# EAGLE schematic RADAR_Main_Board (EAGLE 7.4.0), part 1 of 3

## Sheet 1 of 4: POWER SUPPLIES
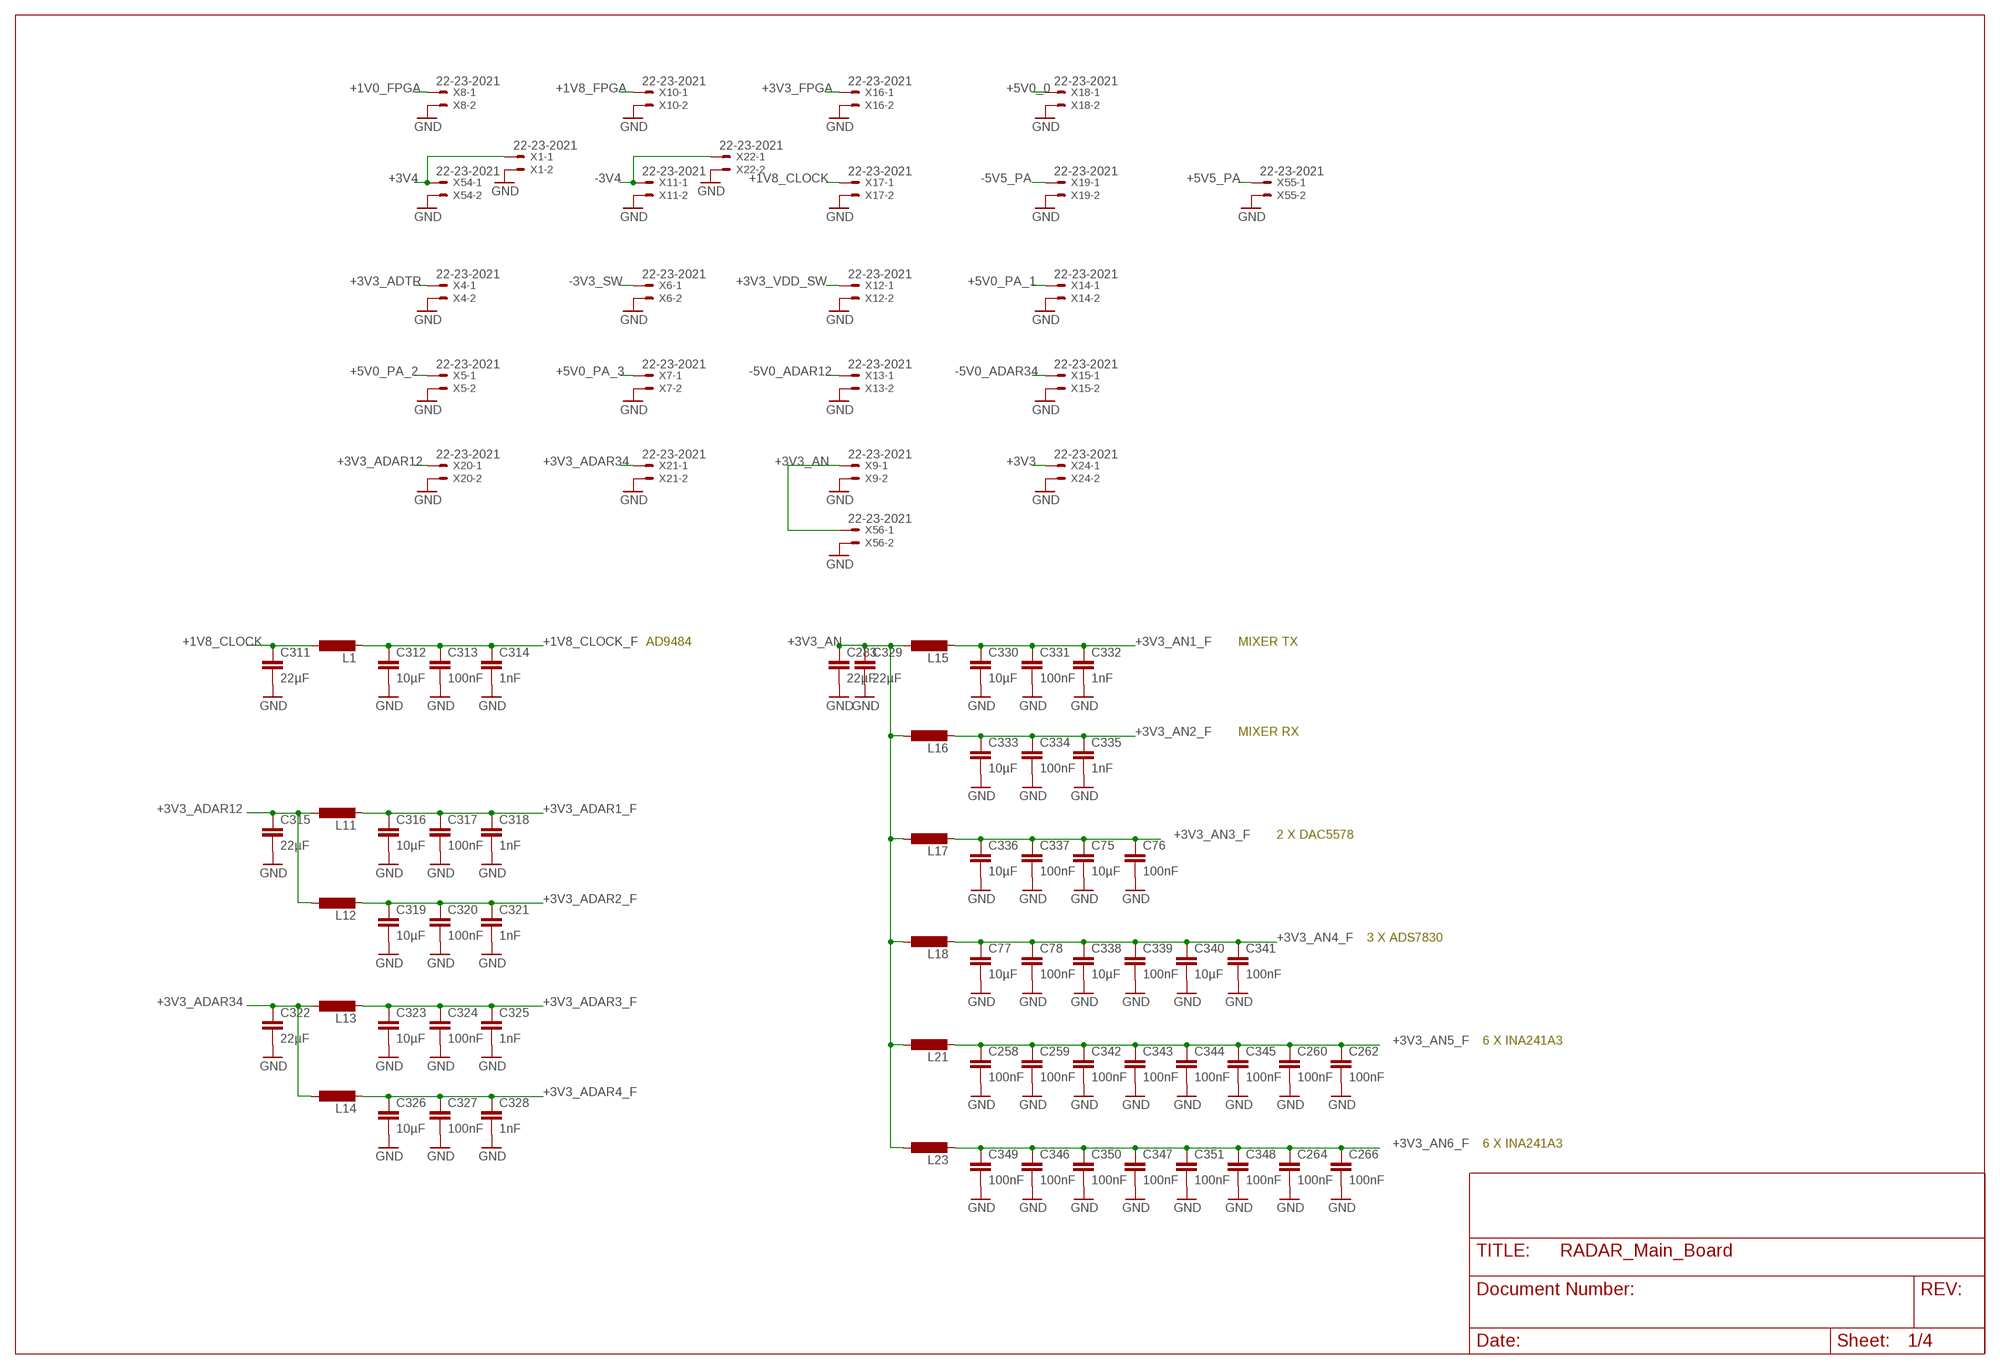
[diagram p0: schematic, sheet 1]

### Parts
C75  10µF  C-EUC0805  [C0805]
C76  100nF  C-EUC0402  [C0402]
C77  10µF  C-EUC0805  [C0805]
C78  100nF  C-EUC0402  [C0402]
C258  100nF  C-EUC0402  [C0402]
C259  100nF  C-EUC0402  [C0402]
C260  100nF  C-EUC0402  [C0402]
C262  100nF  C-EUC0402  [C0402]
C264  100nF  C-EUC0402  [C0402]
C266  100nF  C-EUC0402  [C0402]
C283  22µF  C-EUC1206  [C1206]
C311  22µF  C-EUC1206  [C1206]
C312  10µF  C-EUC0805  [C0805]
C313  100nF  C-EUC0402  [C0402]
C314  1nF  C-EUC0402  [C0402]
C315  22µF  C-EUC1206  [C1206]
C316  10µF  C-EUC0805  [C0805]
C317  100nF  C-EUC0402  [C0402]
C318  1nF  C-EUC0402  [C0402]
C319  10µF  C-EUC0805  [C0805]
C320  100nF  C-EUC0402  [C0402]
C321  1nF  C-EUC0402  [C0402]
C322  22µF  C-EUC1206  [C1206]
C323  10µF  C-EUC0805  [C0805]
C324  100nF  C-EUC0402  [C0402]
C325  1nF  C-EUC0402  [C0402]
C326  10µF  C-EUC0805  [C0805]
C327  100nF  C-EUC0402  [C0402]
C328  1nF  C-EUC0402  [C0402]
C329  22µF  C-EUC1206  [C1206]
C330  10µF  C-EUC0805  [C0805]
C331  100nF  C-EUC0402  [C0402]
C332  1nF  C-EUC0402  [C0402]
C333  10µF  C-EUC0805  [C0805]
C334  100nF  C-EUC0402  [C0402]
C335  1nF  C-EUC0402  [C0402]
C336  10µF  C-EUC0805  [C0805]
C337  100nF  C-EUC0402  [C0402]
C338  10µF  C-EUC0805  [C0805]
C339  100nF  C-EUC0402  [C0402]
C340  10µF  C-EUC0805  [C0805]
C341  100nF  C-EUC0402  [C0402]
C342  100nF  C-EUC0402  [C0402]
C343  100nF  C-EUC0402  [C0402]
C344  100nF  C-EUC0402  [C0402]
C345  100nF  C-EUC0402  [C0402]
C346  100nF  C-EUC0402  [C0402]
C347  100nF  C-EUC0402  [C0402]
C348  100nF  C-EUC0402  [C0402]
C349  100nF  C-EUC0402  [C0402]
C350  100nF  C-EUC0402  [C0402]
C351  100nF  C-EUC0402  [C0402]
L1  L-EUL5650M  [L5650M]
L11  L-EUL5650M  [L5650M]
L12  L-EUL5650M  [L5650M]
L13  L-EUL5650M  [L5650M]
L14  L-EUL5650M  [L5650M]
L15  L-EUL5650M  [L5650M]
L16  L-EUL5650M  [L5650M]
L17  L-EUL5650M  [L5650M]
L18  L-EUL5650M  [L5650M]
L21  L-EUL5650M  [L5650M]
L23  L-EUL5650M  [L5650M]
X1  22-23-2021  [22-23-2021]
X4  22-23-2021  [22-23-2021]
X5  22-23-2021  [22-23-2021]
X6  22-23-2021  [22-23-2021]
X7  22-23-2021  [22-23-2021]
X8  22-23-2021  [22-23-2021]
X9  22-23-2021  [22-23-2021]
X10  22-23-2021  [22-23-2021]
X11  22-23-2021  [22-23-2021]
X12  22-23-2021  [22-23-2021]
X13  22-23-2021  [22-23-2021]
X14  22-23-2021  [22-23-2021]
X15  22-23-2021  [22-23-2021]
X16  22-23-2021  [22-23-2021]
X17  22-23-2021  [22-23-2021]
X18  22-23-2021  [22-23-2021]
X19  22-23-2021  [22-23-2021]
X20  22-23-2021  [22-23-2021]
X21  22-23-2021  [22-23-2021]
X22  22-23-2021  [22-23-2021]
X24  22-23-2021  [22-23-2021]
X54  22-23-2021  [22-23-2021]
X55  22-23-2021  [22-23-2021]
X56  22-23-2021  [22-23-2021]

### Nets
+1V0_FPGA: X8.1 ; also sheet 2
+1V8_CLOCK: C311.1 L1.1 X17.1
+1V8_CLOCK_F: C312.1 C313.1 C314.1 L1.2 ; also sheet 3
+1V8_FPGA: X10.1 ; also sheet 2,3
+3V3: X24.1 ; also sheet 2
+3V3_ADAR1_F: C316.1 C317.1 C318.1 L11.2 ; also sheet 3
+3V3_ADAR2_F: C319.1 C320.1 C321.1 L12.2 ; also sheet 3
+3V3_ADAR3_F: C323.1 C324.1 C325.1 L13.2 ; also sheet 3
+3V3_ADAR4_F: C326.1 C327.1 C328.1 L14.2 ; also sheet 3
+3V3_ADAR12: C315.1 L11.1 L12.1 X20.1
+3V3_ADAR34: C322.1 L13.1 L14.1 X21.1
+3V3_ADTR: X4.1 ; also sheet 3
+3V3_AN: C283.1 C329.1 L15.1 L16.1 L17.1 L18.1 L21.1 L23.1 X9.1 X56.1 ; also sheet 3
+3V3_AN1_F: C330.1 C331.1 C332.1 L15.2 ; also sheet 3
+3V3_AN2_F: C333.1 C334.1 C335.1 L16.2 ; also sheet 3
+3V3_AN3_F: C75.1 C76.1 C336.1 C337.1 L17.2 ; also sheet 4
+3V3_AN4_F: C77.1 C78.1 C338.1 C339.1 C340.1 C341.1 L18.2 ; also sheet 4
+3V3_AN5_F: C258.1 C259.1 C260.1 C262.1 C342.1 C343.1 C344.1 C345.1 L21.2 ; also sheet 4
+3V3_AN6_F: C264.1 C266.1 C346.1 C347.1 C348.1 C349.1 C350.1 C351.1 L23.2 ; also sheet 4
+3V3_FPGA: X16.1 ; also sheet 2,3
+3V3_VDD_SW: X12.1 ; also sheet 3
+3V4: X1.1 X54.1 ; also sheet 3
+5V0_0: X18.1 ; also sheet 3
+5V0_PA_1: X14.1 ; also sheet 3
+5V0_PA_2: X5.1 ; also sheet 3
+5V0_PA_3: X7.1 ; also sheet 3
+5V5_PA: X55.1 ; also sheet 4
-3V3_SW: X6.1 ; also sheet 3
-3V4: X11.1 X22.1 ; also sheet 3
-5V0_ADAR12: X13.1 ; also sheet 3
-5V0_ADAR34: X15.1 ; also sheet 3
-5V5_PA: X19.1 ; also sheet 4
GND: C75.2 C76.2 C77.2 C78.2 C258.2 C259.2 C260.2 C262.2 C264.2 C266.2 C283.2 C311.2 C312.2 C313.2 C314.2 C315.2 C316.2 C317.2 C318.2 C319.2 C320.2 C321.2 C322.2 C323.2 C324.2 C325.2 C326.2 C327.2 C328.2 C329.2 C330.2 C331.2 C332.2 C333.2 C334.2 C335.2 C336.2 C337.2 C338.2 C339.2 C340.2 C341.2 C342.2 C343.2 C344.2 C345.2 C346.2 C347.2 C348.2 C349.2 C350.2 C351.2 X1.2 X4.2 X5.2 X6.2 X7.2 X8.2 X9.2 X10.2 X11.2 X12.2 X13.2 X14.2 X15.2 X16.2 X17.2 X18.2 X19.2 X20.2 X21.2 X22.2 X24.2 X54.2 X55.2 X56.2 ; also sheet 2,3,4

### Notes on the sheet
- AD9484 | MIXER TX
- MIXER RX
- 2 X DAC5578
- 3 X ADS7830
- 6 X INA241A3
- 6 X INA241A3

## Sheet 2 of 4: Digital (FPGA+microcontroller)
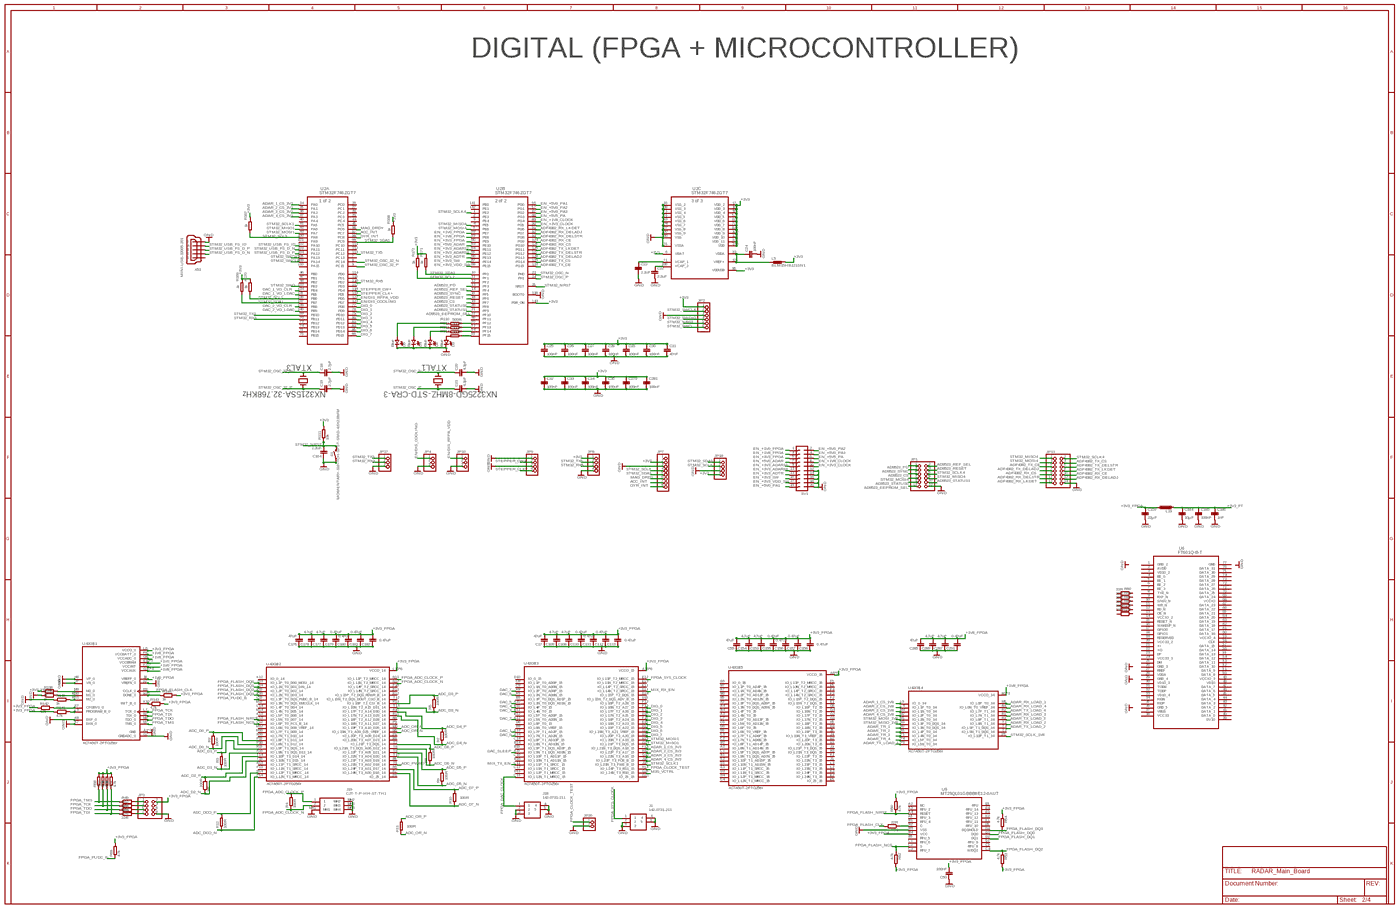
[diagram p1: schematic, sheet 2, overview]
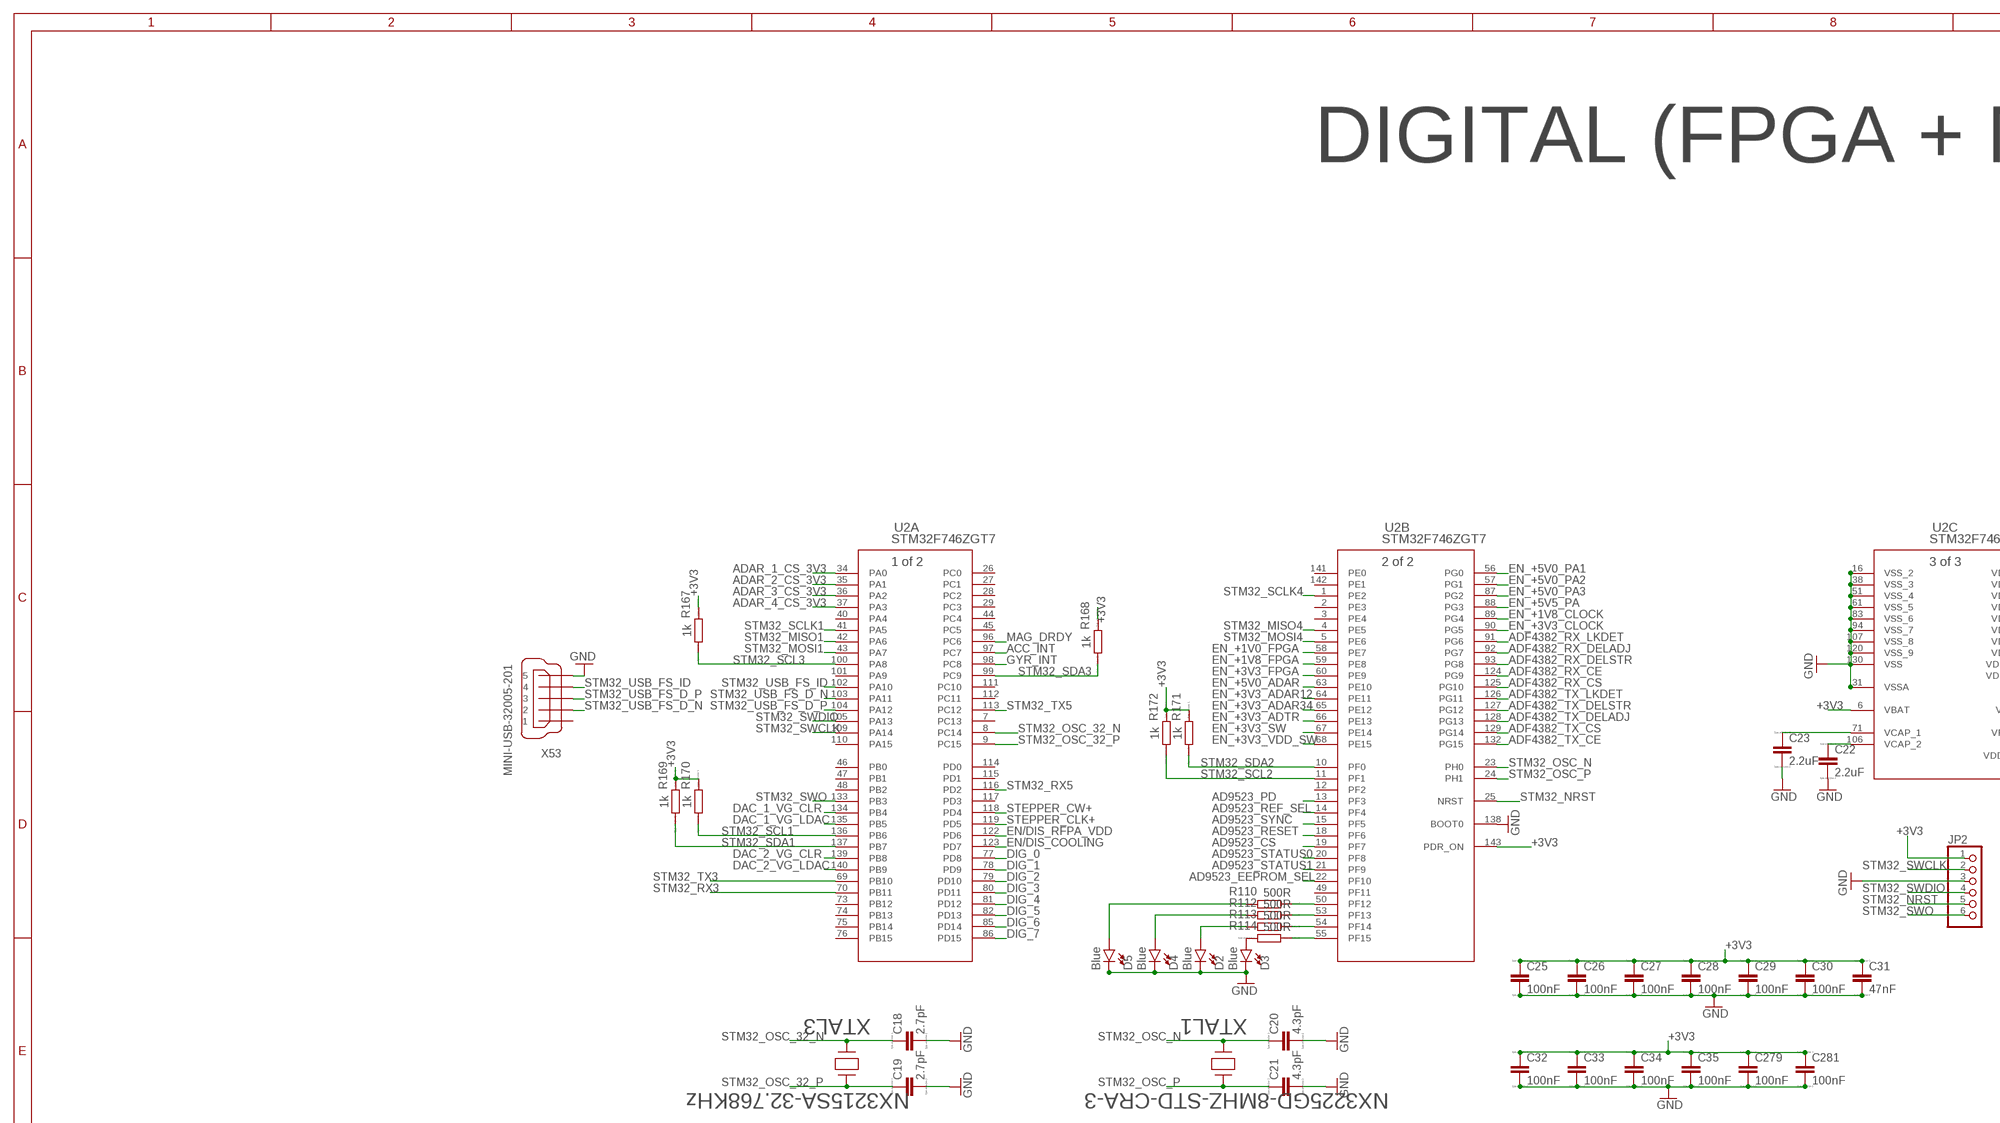
[diagram p2: schematic, sheet 2, part 1 of 4]
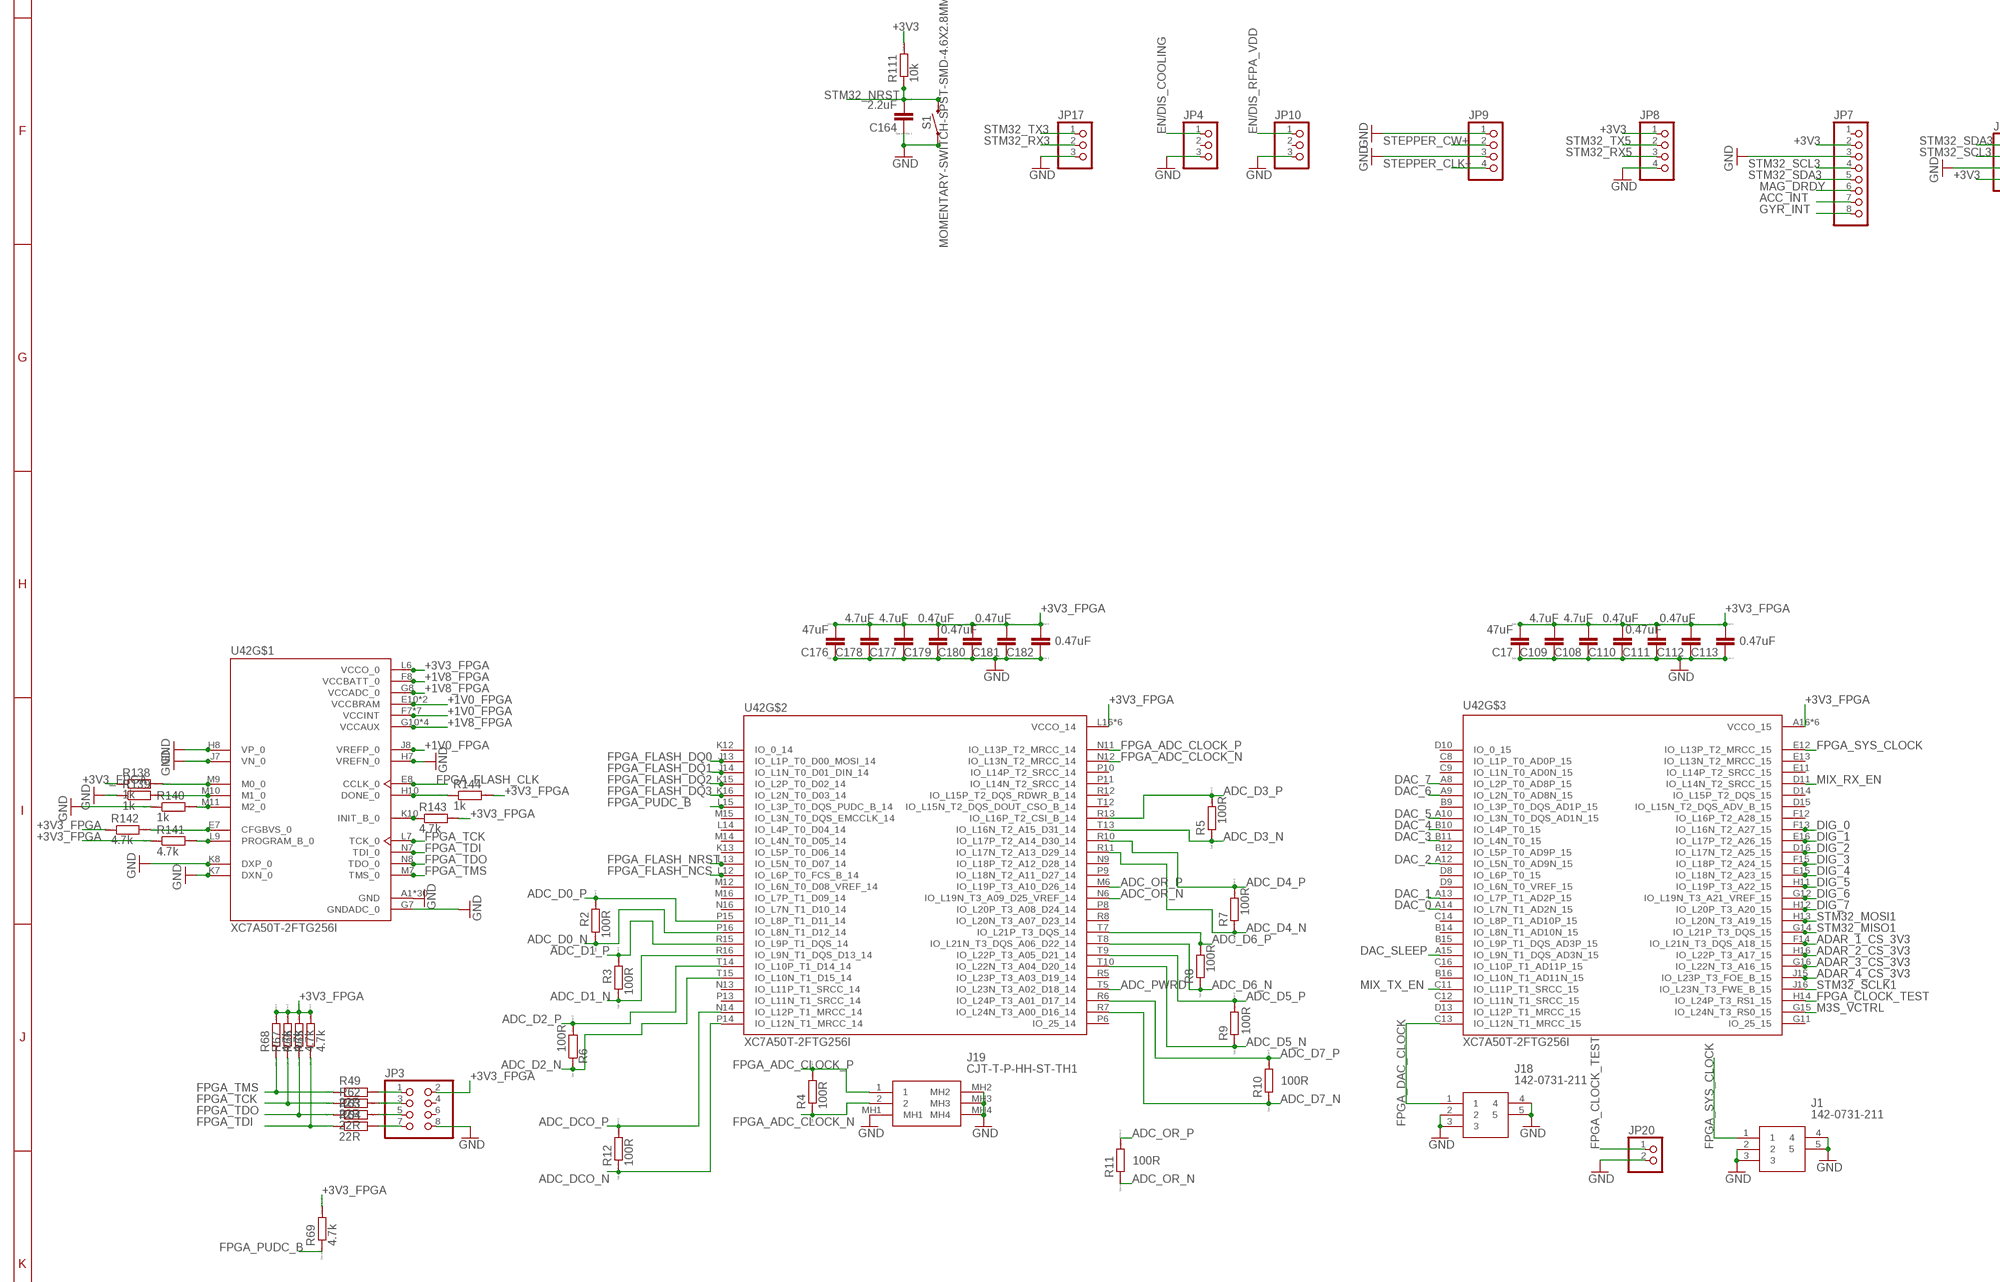
[diagram p3: schematic, sheet 2, part 2 of 4]
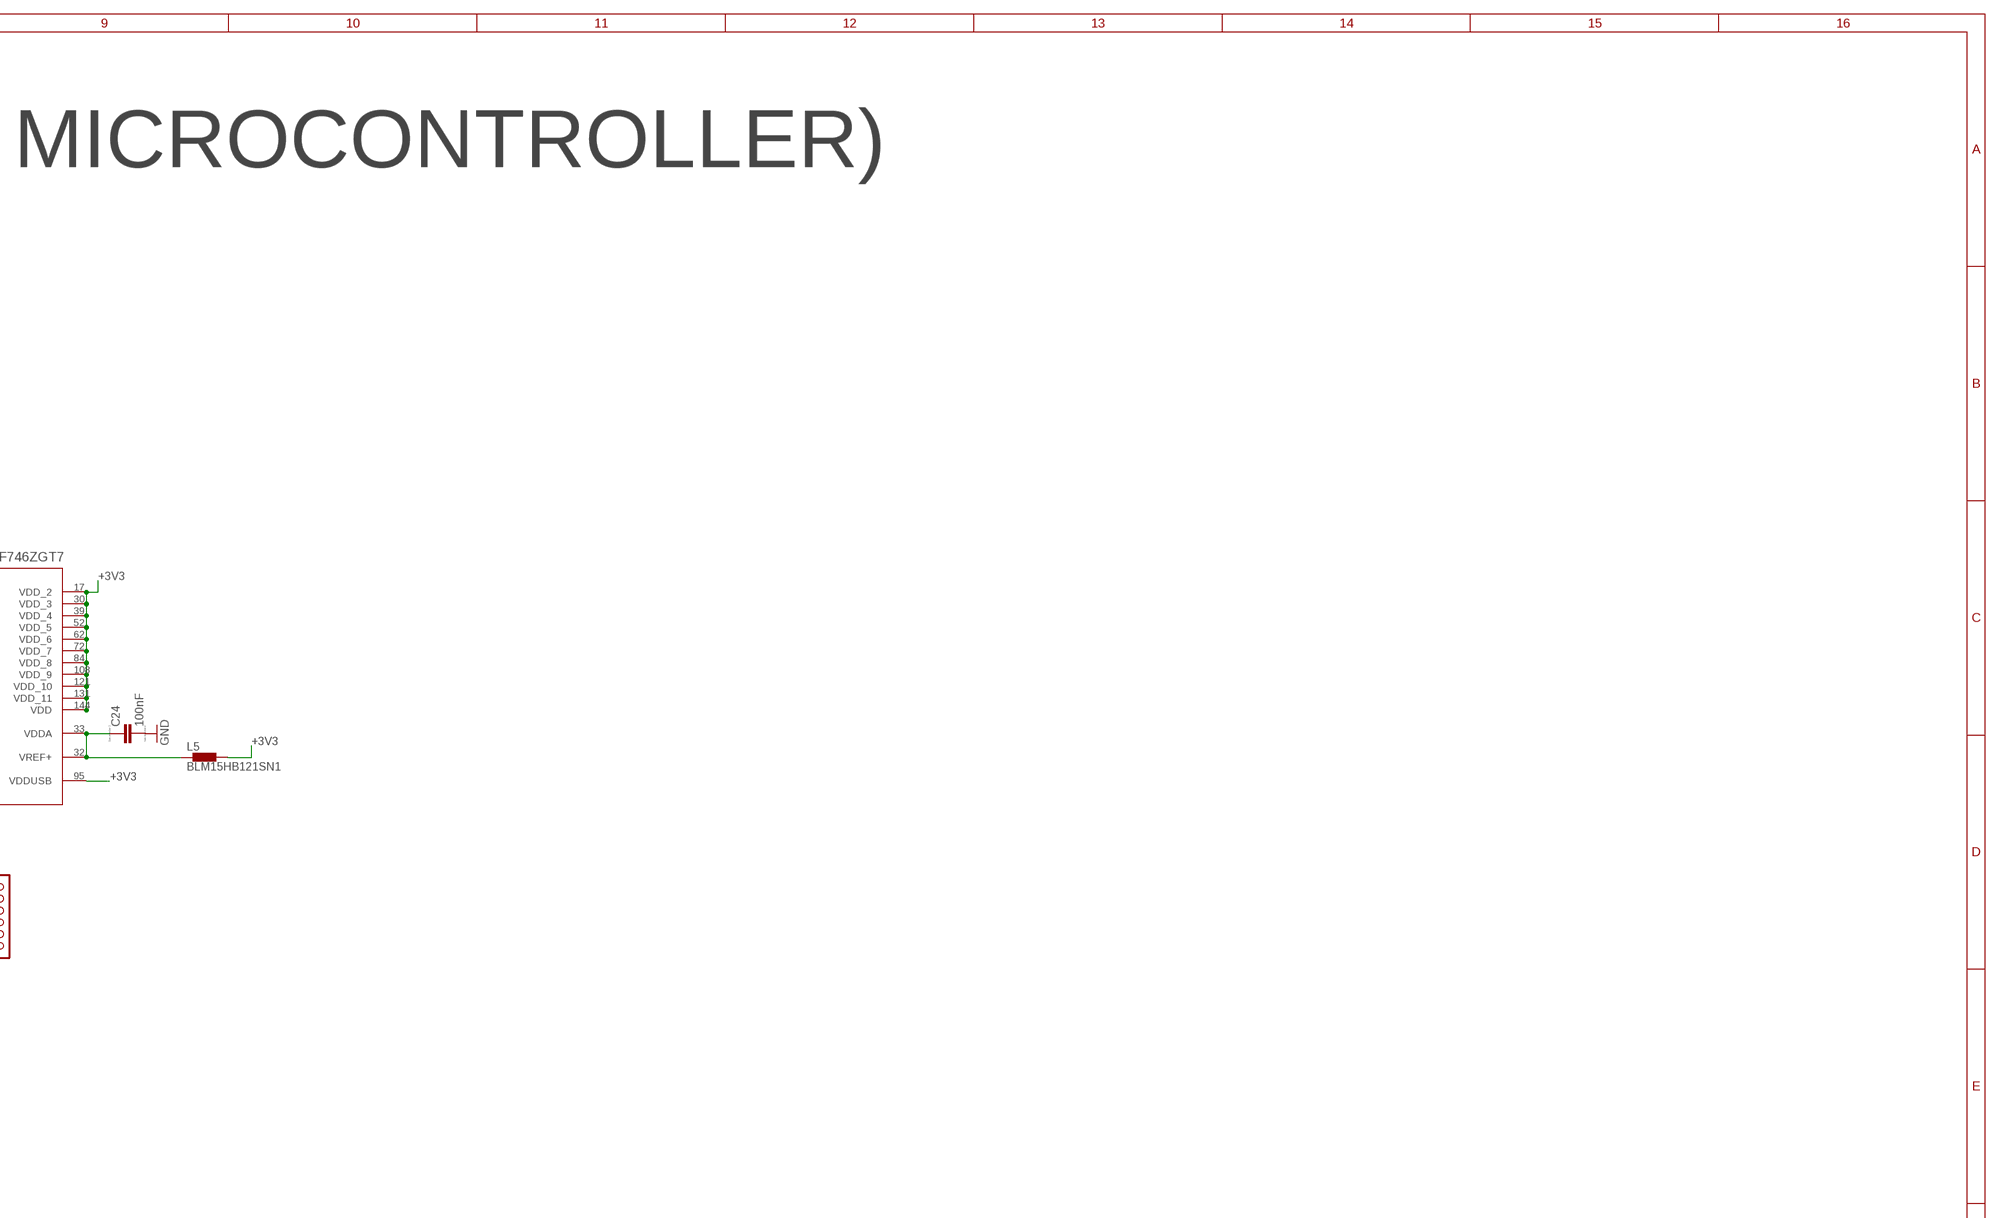
[diagram p4: schematic, sheet 2, part 3 of 4]
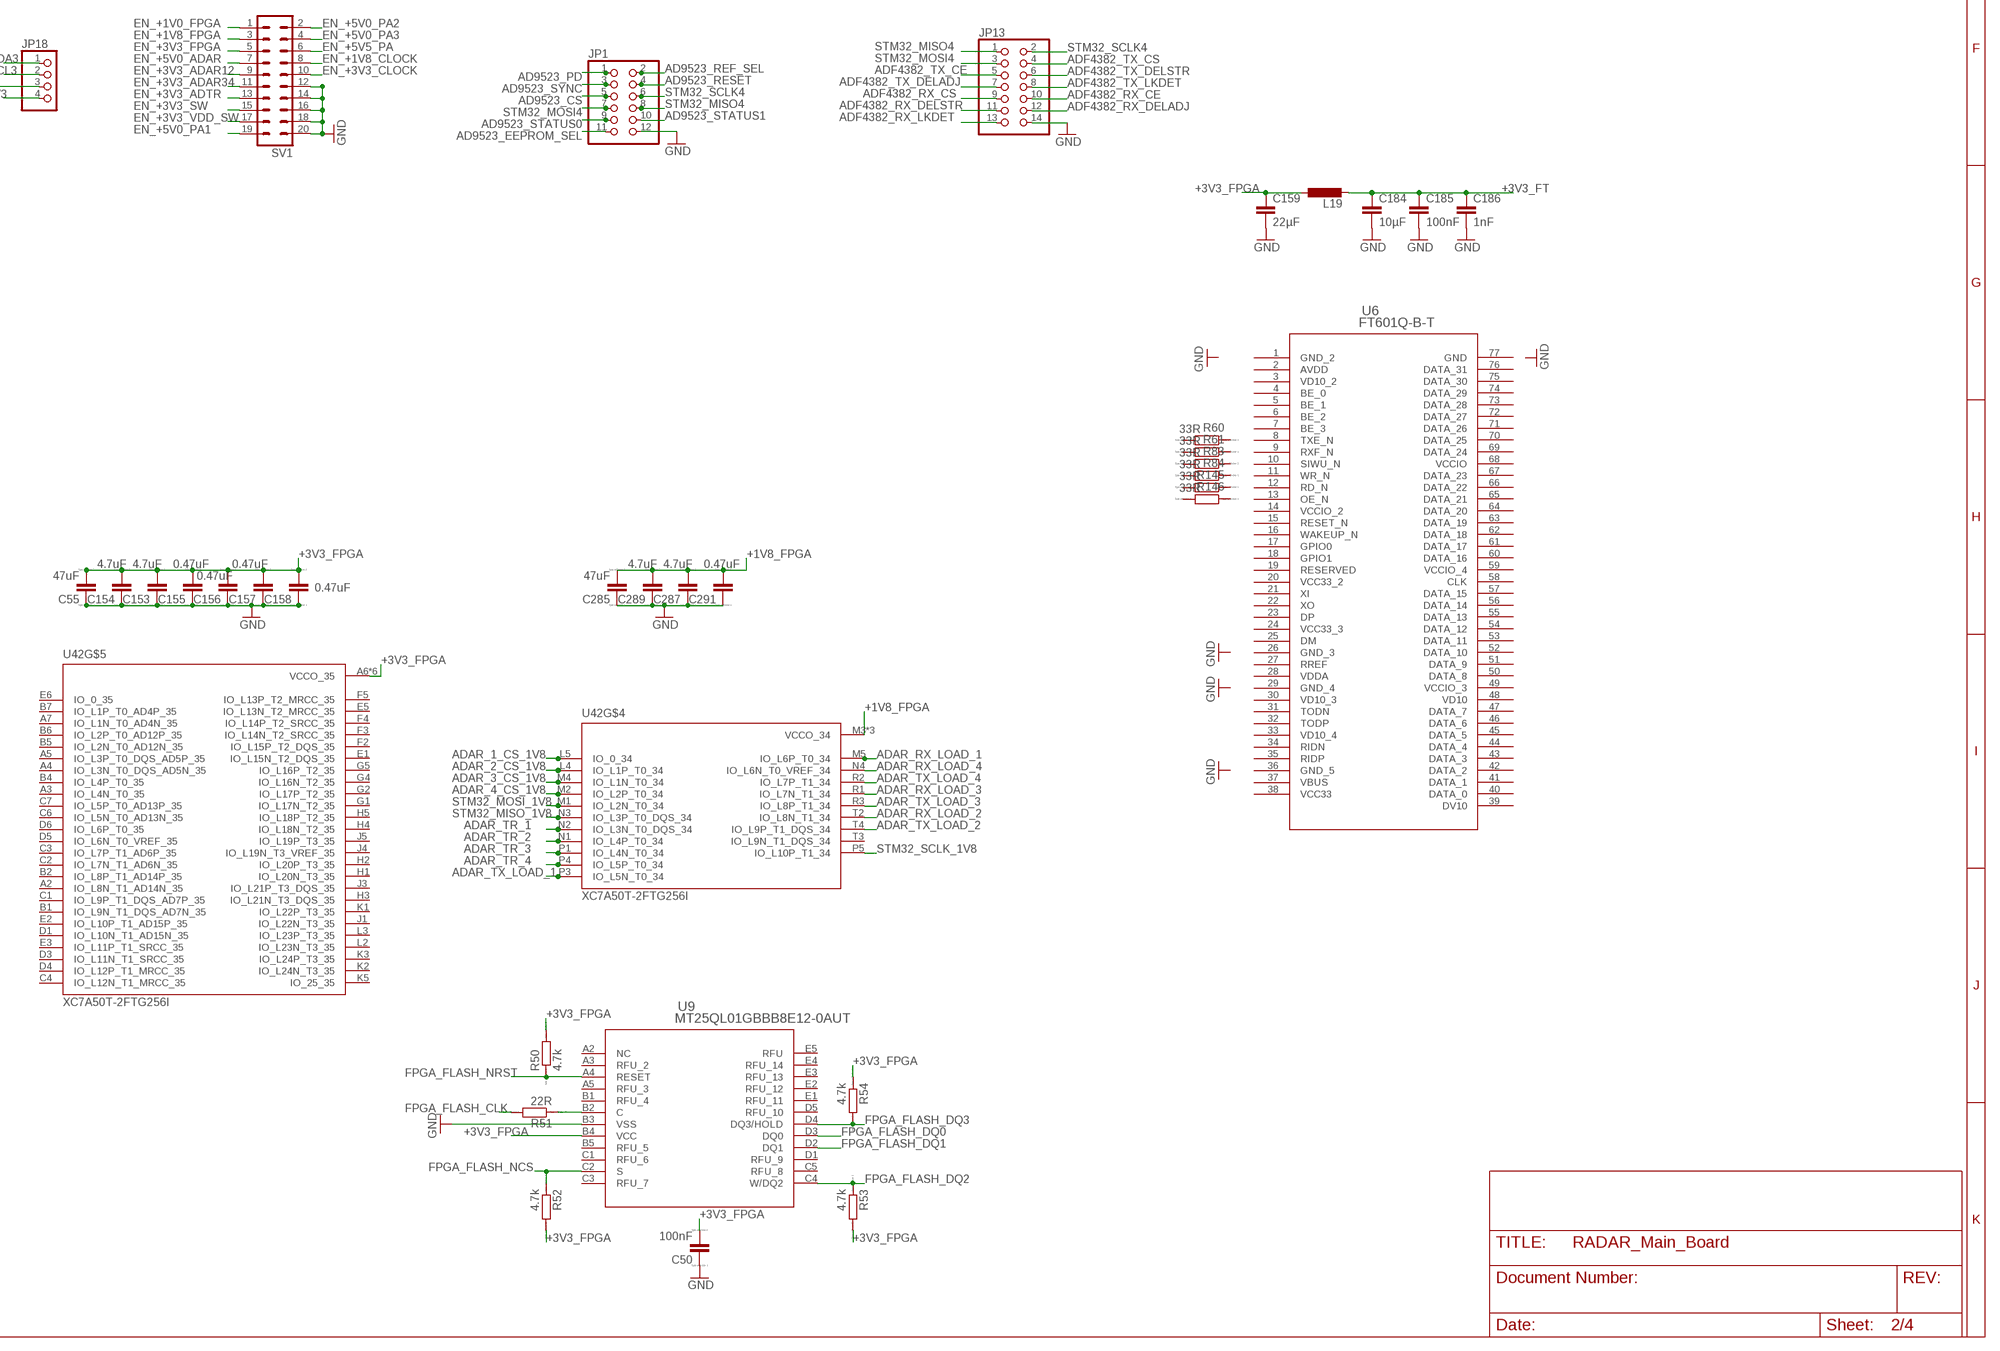
[diagram p5: schematic, sheet 2, part 4 of 4]

### Parts
C17  47uF  CC0201  [C0201]
C18  2.7pF  CC0201  [C0201]
C19  2.7pF  CC0201  [C0201]
C20  4.3pF  CC0201  [C0201]
C21  4.3pF  CC0201  [C0201]
C22  2.2uF  CC0201  [C0201]
C23  2.2uF  CC0201  [C0201]
C24  100nF  CC0201  [C0201]
C25  100nF  CC0201  [C0201]
C26  100nF  CC0201  [C0201]
C27  100nF  CC0201  [C0201]
C28  100nF  CC0201  [C0201]
C29  100nF  CC0201  [C0201]
C30  100nF  CC0201  [C0201]
C31  47nF  CC0201  [C0201]
C32  100nF  CC0201  [C0201]
C33  100nF  CC0201  [C0201]
C34  100nF  CC0201  [C0201]
C35  100nF  CC0201  [C0201]
C50  100nF  CC0201  [C0201]
C55  47uF  CC0201  [C0201]
C108  4.7uF  CC0201  [C0201]
C109  4.7uF  CC0201  [C0201]
C110  0.47uF  CC0201  [C0201]
C111  0.47uF  CC0201  [C0201]
C112  0.47uF  CC0201  [C0201]
C113  0.47uF  CC0201  [C0201]
C153  4.7uF  CC0201  [C0201]
C154  4.7uF  CC0201  [C0201]
C155  0.47uF  CC0201  [C0201]
C156  0.47uF  CC0201  [C0201]
C157  0.47uF  CC0201  [C0201]
C158  0.47uF  CC0201  [C0201]
C159  22µF  C-EUC1206  [C1206]
C164  2.2uF  CC0201  [C0201]
C176  47uF  CC0201  [C0201]
C177  4.7uF  CC0201  [C0201]
C178  4.7uF  CC0201  [C0201]
C179  0.47uF  CC0201  [C0201]
C180  0.47uF  CC0201  [C0201]
C181  0.47uF  CC0201  [C0201]
C182  0.47uF  CC0201  [C0201]
C184  10µF  C-EUC0805  [C0805]
C185  100nF  C-EUC0402  [C0402]
C186  1nF  C-EUC0402  [C0402]
C279  100nF  CC0201  [C0201]
C281  100nF  CC0201  [C0201]
C285  47uF  CC0201  [C0201]
C287  4.7uF  CC0201  [C0201]
C289  4.7uF  CC0201  [C0201]
C291  0.47uF  CC0201  [C0201]
D2  Blue  LED-BLUE0603  [LED-0603]
D3  Blue  LED-BLUE0603  [LED-0603]
D4  Blue  LED-BLUE0603  [LED-0603]
D5  Blue  LED-BLUE0603  [LED-0603]
J1  142-0731-211  [1420731211]
J18  142-0731-211  [1420731211]
J19  CJT-T-P-HH-ST-TH1  [CJTTPHHSTTH1]
JP1  PINHD-2X6  [2X06]
JP2  PINHD-1X6  [1X06]
JP3  PINHD-2X4  [2X04]
JP4  PINHD-1X3  [1X03]
JP7  PINHD-1X8  [1X08]
JP8  PINHD-1X4  [1X04]
JP9  PINHD-1X4  [1X04]
JP10  PINHD-1X3  [1X03]
JP13  PINHD-2X7  [2X07]
JP17  PINHD-1X3  [1X03]
JP18  PINHD-1X4  [1X04]
JP20  PINHD-1X2  [1X02]
L5  BLM15HB121SN1  [0402]
L19  L-EUL5650M  [L5650M]
R2  100R  RR0201  [R0201]
R3  100R  RR0201  [R0201]
R4  100R  RR0201  [R0201]
R5  100R  RR0201  [R0201]
R6  100R  RR0201  [R0201]
R7  100R  RR0201  [R0201]
R8  100R  RR0201  [R0201]
R9  100R  RR0201  [R0201]
R10  100R  RR0201  [R0201]
R11  100R  RR0201  [R0201]
R12  100R  RR0201  [R0201]
R49  22R  RR0201  [R0201]
R50  4.7k  RR0201  [R0201]
R51  22R  RR0201  [R0201]
R52  4.7k  RR0201  [R0201]
R53  4.7k  RR0201  [R0201]
R54  4.7k  RR0201  [R0201]
R60  33R  RR0201  [R0201]
R61  33R  RR0201  [R0201]
R62  22R  RR0201  [R0201]
R63  22R  RR0201  [R0201]
R64  22R  RR0201  [R0201]
R65  4.7k  RR0201  [R0201]
R66  4.7k  RR0201  [R0201]
R67  4.7k  RR0201  [R0201]
R68  4.7k  RR0201  [R0201]
R69  4.7k  RR0201  [R0201]
R83  33R  RR0201  [R0201]
R84  33R  RR0201  [R0201]
R110  500R  RR0201  [R0201]
R111  10k  RR0201  [R0201]
R112  500R  RR0201  [R0201]
R113  500R  RR0201  [R0201]
R114  500R  RR0201  [R0201]
R138  1k  RR0201  [R0201]
R139  1k  RR0201  [R0201]
R140  1k  RR0201  [R0201]
R141  4.7k  RR0201  [R0201]
R142  4.7k  RR0201  [R0201]
R143  4.7k  RR0201  [R0201]
R144  1k  RR0201  [R0201]
R145  33R  RR0201  [R0201]
R146  33R  RR0201  [R0201]
R167  1k  RR0201  [R0201]
R168  1k  RR0201  [R0201]
R169  1k  RR0201  [R0201]
R170  1k  RR0201  [R0201]
R171  1k  RR0201  [R0201]
R172  1k  RR0201  [R0201]
S1  MOMENTARY-SWITCH-SPST-SMD-4.6X2.8MM  [TACTILE_SWITCH_SMD_4.6X2.8MM]
SV1  MA10-2  [MA10-2]
U2  STM32F746ZGT7  [LQFP-144_STM]
U6  FT601Q-B-T  [QFN76_FTD]
U9  MT25QL01GBBB8E12-0AUT  [BGA24_MT25QL_MRN]
U42  XC7A50T-2FTG256I  [BGA256C100P16X16_1700X1700X155]
X53  MINI-USB-32005-201  [32005-201]
XTAL1  NX3225GD-8MHZ-STD-CRA-3  [XTAL_NX3225GD-8MHZ-STD-CRA-3_N]
XTAL3  NX3215SA-32.768KHz  NX3225GD-8MHZ-STD-CRA-3  [XTAL_NX3225GD-8MHZ-STD-CRA-3_N]

### Nets
+1V0_FPGA: U42.E10(VCCBRAM) U42.F7(VCCINT) U42.F9(VCCINT) U42.F11(VCCBRAM) U42.G6(VCCINT) U42.H9(VCCINT) U42.J6(VCCINT) U42.J8(VREFP_0) U42.K9(VCCINT) U42.L8(VCCINT) ; also sheet 1
+1V8_FPGA: C285.2 C287.2 C289.2 C291.2 U42.F8(VCCBATT_0) U42.G8(VCCADC_0) U42.G10(VCCAUX) U42.J10(VCCAUX) U42.K11(VCCAUX) U42.L10(VCCAUX) U42.M3(VCCO_34) U42.R4(VCCO_34) U42.T1(VCCO_34) ; also sheet 1,3
+3V3: C25.1 C26.1 C27.1 C28.1 C29.1 C30.1 C31.1 C32.1 C33.1 C34.1 C35.1 C279.1 C281.1 JP2.1 JP7.2 JP8.1 JP18.4 L5.2 R111.2 R167.1 R168.1 R169.1 R170.1 R171.1 R172.1 U2.6(C:VBAT) U2.17(C:VDD_2) U2.30(C:VDD_3) U2.39(C:VDD_4) U2.52(C:VDD_5) U2.62(C:VDD_6) U2.72(C:VDD_7) U2.84(C:VDD_8) U2.95(C:VDDUSB) U2.108(C:VDD_9) U2.121(C:VDD_10) U2.131(C:VDD_11) U2.143(B:PDR_ON) U2.144(C:VDD) ; also sheet 1
+3V3_FPGA: C17.2 C50.2 C55.2 C108.2 C109.2 C110.2 C111.2 C112.2 C113.2 C153.2 C154.2 C155.2 C156.2 C157.2 C158.2 C159.1 C176.2 C177.2 C178.2 C179.2 C180.2 C181.2 C182.2 JP3.2 L19.1 R50.2 R52.2 R53.2 R54.1 R65.2 R66.2 R67.2 R68.2 R69.2 R138.1 R141.1 R142.1 R143.2 R144.2 U9.B4(VCC) U42.A6(VCCO_35) U42.A16(VCCO_15) U42.B3(VCCO_35) U42.B13(VCCO_15) U42.C10(VCCO_15) U42.D7(VCCO_35) U42.E4(VCCO_35) U42.E14(VCCO_15) U42.F1(VCCO_35) U42.H15(VCCO_15) U42.J2(VCCO_35) U42.J12(VCCO_15) U42.L6(VCCO_0) U42.L16(VCCO_14) U42.M13(VCCO_14) U42.N10(VCCO_14) U42.P7(VCCO_14) U42.R14(VCCO_14) U42.T11(VCCO_14) ; also sheet 1,3
+3V3_FT: C184.1 C185.1 C186.1 L19.2
ACC_INT: JP7.7 U2.97(A:PC7)
AD9523_CS: JP1.5 U2.19(B:PF7)
AD9523_EEPROM_SEL: JP1.11 U2.22(B:PF10)
AD9523_PD: JP1.1 U2.13(B:PF3)
AD9523_REF_SEL: JP1.2 U2.14(B:PF4)
AD9523_RESET: JP1.4 U2.18(B:PF6)
AD9523_STATUS0: JP1.9 U2.20(B:PF8)
AD9523_STATUS1: JP1.10 U2.21(B:PF9)
AD9523_SYNC: JP1.3 U2.15(B:PF5)
ADAR_1_CS_1V8: U42.L5(IO_0_34) ; also sheet 3
ADAR_1_CS_3V3: U2.34(A:PA0) U42.F14(IO_L21N_T3_DQS_A18_15)
ADAR_2_CS_1V8: U42.L4(IO_L1P_T0_34) ; also sheet 3
ADAR_2_CS_3V3: U2.35(A:PA1) U42.H16(IO_L22P_T3_A17_15)
ADAR_3_CS_1V8: U42.M4(IO_L1N_T0_34) ; also sheet 3
ADAR_3_CS_3V3: U2.36(A:PA2) U42.G16(IO_L22N_T3_A16_15)
ADAR_4_CS_1V8: U42.M2(IO_L2P_T0_34) ; also sheet 3
ADAR_4_CS_3V3: U2.37(A:PA3) U42.J15(IO_L23P_T3_FOE_B_15)
ADAR_RX_LOAD_1: U42.M5(IO_L6P_T0_34) ; also sheet 3
ADAR_RX_LOAD_2: U42.T2(IO_L8N_T1_34) ; also sheet 3
ADAR_RX_LOAD_3: U42.R1(IO_L7N_T1_34) ; also sheet 3
ADAR_RX_LOAD_4: U42.N4(IO_L6N_T0_VREF_34) ; also sheet 3
ADAR_TR_1: U42.N2(IO_L3N_T0_DQS_34) ; also sheet 3
ADAR_TR_2: U42.N1(IO_L4P_T0_34) ; also sheet 3
ADAR_TR_3: U42.P1(IO_L4N_T0_34) ; also sheet 3
ADAR_TR_4: U42.P4(IO_L5P_T0_34) ; also sheet 3
ADAR_TX_LOAD_1: U42.P3(IO_L5N_T0_34) ; also sheet 3
ADAR_TX_LOAD_2: U42.T4(IO_L9P_T1_DQS_34) ; also sheet 3
ADAR_TX_LOAD_3: U42.R3(IO_L8P_T1_34) ; also sheet 3
ADAR_TX_LOAD_4: U42.R2(IO_L7P_T1_34) ; also sheet 3
ADC_D0_N [Differential]: R2.1 U42.P16(IO_L8N_T1_D12_14) ; also sheet 3
ADC_D0_P [Differential]: R2.2 U42.P15(IO_L8P_T1_D11_14) ; also sheet 3
ADC_D1_N [Differential]: R3.1 U42.R16(IO_L9N_T1_DQS_D13_14) ; also sheet 3
ADC_D1_P [Differential]: R3.2 U42.R15(IO_L9P_T1_DQS_14) ; also sheet 3
ADC_D2_N [Differential]: R6.1 U42.T15(IO_L10N_T1_D15_14) ; also sheet 3
ADC_D2_P [Differential]: R6.2 U42.T14(IO_L10P_T1_D14_14) ; also sheet 3
ADC_D3_N [Differential]: R5.1 U42.T13(IO_L16N_T2_A15_D31_14) ; also sheet 3
ADC_D3_P [Differential]: R5.2 U42.R13(IO_L16P_T2_CSI_B_14) ; also sheet 3
ADC_D4_N [Differential]: R7.1 U42.R11(IO_L17N_T2_A13_D29_14) ; also sheet 3
ADC_D4_P [Differential]: R7.2 U42.R10(IO_L17P_T2_A14_D30_14) ; also sheet 3
ADC_D5_N [Differential]: R9.1 U42.T10(IO_L22N_T3_A04_D20_14) ; also sheet 3
ADC_D5_P [Differential]: R9.2 U42.T9(IO_L22P_T3_A05_D21_14) ; also sheet 3
ADC_D6_N [Differential]: R8.1 U42.T8(IO_L21N_T3_DQS_A06_D22_14) ; also sheet 3
ADC_D6_P [Differential]: R8.2 U42.T7(IO_L21P_T3_DQS_14) ; also sheet 3
ADC_D7_N [Differential]: R10.1 U42.R7(IO_L24N_T3_A00_D16_14) ; also sheet 3
ADC_D7_P [Differential]: R10.2 U42.R6(IO_L24P_T3_A01_D17_14) ; also sheet 3
ADC_DCO_N [Differential]: R12.1 U42.P14(IO_L12N_T1_MRCC_14) ; also sheet 3
ADC_DCO_P [Differential]: R12.2 U42.N14(IO_L12P_T1_MRCC_14) ; also sheet 3
ADC_OR_N [Differential]: R11.1 U42.N6(IO_L19N_T3_A09_D25_VREF_14) ; also sheet 3
ADC_OR_P [Differential]: R11.2 U42.M6(IO_L19P_T3_A10_D26_14) ; also sheet 3
ADC_PWRD: U42.T5(IO_L23N_T3_A02_D18_14) ; also sheet 3
ADF4382_RX_CE: JP13.10 U2.124(B:PG9)
ADF4382_RX_CS: JP13.9 U2.125(B:PG10)
ADF4382_RX_DELADJ: JP13.12 U2.92(B:PG7)
ADF4382_RX_DELSTR: JP13.11 U2.93(B:PG8)
ADF4382_RX_LKDET: JP13.13 U2.91(B:PG6)
ADF4382_TX_CE: JP13.5 U2.132(B:PG15)
ADF4382_TX_CS: JP13.4 U2.129(B:PG14)
ADF4382_TX_DELADJ: JP13.7 U2.128(B:PG13)
ADF4382_TX_DELSTR: JP13.6 U2.127(B:PG12)
ADF4382_TX_LKDET: JP13.8 U2.126(B:PG11)
DAC_0 [Single_Ended Clocks & RF]: U42.A14(IO_L7N_T1_AD2N_15) ; also sheet 3
DAC_1 [Single_Ended Clocks & RF]: U42.A13(IO_L7P_T1_AD2P_15) ; also sheet 3
DAC_1_VG_CLR: U2.134(A:PB4) ; also sheet 4
DAC_1_VG_LDAC: U2.135(A:PB5) ; also sheet 4
DAC_2 [Single_Ended Clocks & RF]: U42.A12(IO_L5N_T0_AD9N_15) ; also sheet 3
DAC_2_VG_CLR: U2.139(A:PB8) ; also sheet 4
DAC_2_VG_LDAC: U2.140(A:PB9) ; also sheet 4
DAC_3 [Single_Ended Clocks & RF]: U42.B11(IO_L4N_T0_15) ; also sheet 3
DAC_4 [Single_Ended Clocks & RF]: U42.B10(IO_L4P_T0_15) ; also sheet 3
DAC_5 [Single_Ended Clocks & RF]: U42.A10(IO_L3N_T0_DQS_AD1N_15) ; also sheet 3
DAC_6 [Single_Ended Clocks & RF]: U42.A9(IO_L2N_T0_AD8N_15) ; also sheet 3
DAC_7 [Single_Ended Clocks & RF]: U42.A8(IO_L2P_T0_AD8P_15) ; also sheet 3
DAC_SLEEP: U42.A15(IO_L9N_T1_DQS_AD3N_15) ; also sheet 3
DIG_0: U2.77(A:PD8) U42.F13(IO_L16N_T2_A27_15)
DIG_1: U2.78(A:PD9) U42.E16(IO_L17P_T2_A26_15)
DIG_2: U2.79(A:PD10) U42.D16(IO_L17N_T2_A25_15)
DIG_3: U2.80(A:PD11) U42.F15(IO_L18P_T2_A24_15)
DIG_4: U2.81(A:PD12) U42.E15(IO_L18N_T2_A23_15)
DIG_5: U2.82(A:PD13) U42.H11(IO_L19P_T3_A22_15)
DIG_6: U2.85(A:PD14) U42.G12(IO_L19N_T3_A21_VREF_15)
DIG_7: U2.86(A:PD15) U42.H12(IO_L20P_T3_A20_15)
EN/DIS_COOLING: JP4.1 U2.123(A:PD7)
EN/DIS_RFPA_VDD: JP10.1 U2.122(A:PD6)
EN_+1V0_FPGA: SV1.1 U2.58(B:PE7)
EN_+1V8_CLOCK: SV1.8 U2.89(B:PG4)
EN_+1V8_FPGA: SV1.3 U2.59(B:PE8)
EN_+3V3_ADAR12: SV1.9 U2.64(B:PE11)
EN_+3V3_ADAR34: SV1.11 U2.65(B:PE12)
EN_+3V3_ADTR: SV1.13 U2.66(B:PE13)
EN_+3V3_CLOCK: SV1.10 U2.90(B:PG5)
EN_+3V3_FPGA: SV1.5 U2.60(B:PE9)
EN_+3V3_SW: SV1.15 U2.67(B:PE14)
EN_+3V3_VDD_SW: SV1.17 U2.68(B:PE15)
EN_+5V0_ADAR: SV1.7 U2.63(B:PE10)
EN_+5V0_PA1: SV1.19 U2.56(B:PG0)
EN_+5V0_PA2: SV1.2 U2.57(B:PG1)
EN_+5V0_PA3: SV1.4 U2.87(B:PG2)
EN_+5V5_PA: SV1.6 U2.88(B:PG3)
FPGA_ADC_CLOCK_N [Differential]: J19.2 R4.1 U42.N12(IO_L13N_T2_MRCC_14)
FPGA_ADC_CLOCK_P [Differential]: J19.1 R4.2 U42.N11(IO_L13P_T2_MRCC_14)
FPGA_CLOCK_TEST [Single_Ended Clocks & RF]: JP20.1 U42.H14(IO_L24P_T3_RS1_15)
FPGA_DAC_CLOCK [Single_Ended Clocks & RF]: J18.1 U42.C13(IO_L12N_T1_MRCC_15)
FPGA_FLASH_CLK [Single_Ended Clocks & RF]: R51.2 U42.E8(CCLK_0)
FPGA_FLASH_DQ0: U9.D3(DQ0) U42.J13(IO_L1P_T0_D00_MOSI_14)
FPGA_FLASH_DQ1: U9.D2(DQ1) U42.J14(IO_L1N_T0_D01_DIN_14)
FPGA_FLASH_DQ2: R53.1 U9.C4(W/DQ2) U42.K15(IO_L2P_T0_D02_14)
FPGA_FLASH_DQ3: R54.2 U9.D4(DQ3/HOLD) U42.K16(IO_L2N_T0_D03_14)
FPGA_FLASH_NCS: R52.1 U9.C2(S) U42.L12(IO_L6P_T0_FCS_B_14)
FPGA_FLASH_NRST: R50.1 U9.A4(RESET) U42.L13(IO_L5N_T0_D07_14)
FPGA_PUDC_B: R69.1 U42.L15(IO_L3P_T0_DQS_PUDC_B_14)
FPGA_SYS_CLOCK [Single_Ended Clocks & RF]: J1.1 U42.E12(IO_L13P_T2_MRCC_15)
FPGA_TCK [Single_Ended Clocks & RF]: R62.1 R67.1 U42.L7(TCK_0)
FPGA_TDI: R64.1 R65.1 U42.N7(TDI_0)
FPGA_TDO: R63.1 R66.1 U42.N8(TDO_0)
FPGA_TMS: R49.1 R68.1 U42.M7(TMS_0)
GND: C17.1 C18.2 C19.2 C20.2 C21.2 C22.2 C23.2 C24.2 C25.2 C26.2 C27.2 C28.2 C29.2 C30.2 C31.2 C32.2 C33.2 C34.2 C35.2 C50.1 C55.1 C108.1 C109.1 C110.1 C111.1 C112.1 C113.1 C153.1 C154.1 C155.1 C156.1 C157.1 C158.1 C159.2 C164.1 C176.1 C177.1 C178.1 C179.1 C180.1 C181.1 C182.1 C184.2 C185.2 C186.2 C279.2 C281.2 C285.1 C287.1 C289.1 C291.1 D2.C D3.C D4.C D5.C J1.2 J1.3 J1.4 J1.5 J18.2 J18.3 J18.4 J18.5 J19.MH1 J19.MH2 J19.MH3 J19.MH4 JP1.12 JP2.3 JP3.8 JP4.3 JP7.3 JP8.4 JP9.1 JP9.3 JP10.3 JP13.14 JP17.3 JP18.3 JP20.2 R139.1 R140.1 S1.1 S1.2 SV1.12 SV1.14 SV1.16 SV1.18 SV1.20 U2.16(C:VSS_2) U2.31(C:VSSA) U2.38(C:VSS_3) U2.51(C:VSS_4) U2.61(C:VSS_5) U2.83(C:VSS_6) U2.94(C:VSS_7) U2.107(C:VSS_8) U2.120(C:VSS_9) U2.130(C:VSS) U2.138(B:BOOT0) U9.B3(VSS) U42.A1(GND) U42.A11(GND) U42.B8(GND) U42.C5(GND) U42.C15(GND) U42.D2(GND) U42.D12(GND) U42.E9(GND) U42.F6(GND) U42.F10(GND) U42.F16(GND) U42.G3(GND) U42.G7(GNDADC_0) U42.G9(GND) U42.G13(GND) U42.H6(GND) U42.H7(VREFN_0) U42.H8(VP_0) U42.J7(VN_0) U42.J9(GND) U42.J11(GND) U42.K4(GND) U42.K6(GND) U42.K7(DXN_0) U42.K8(DXP_0) U42.K14(GND) U42.L1(GND) U42.L11(GND) U42.M8(GND) U42.N5(GND) U42.N15(GND) U42.P2(GND) U42.P12(GND) U42.R9(GND) U42.T6(GND) U42.T16(GND) X53.5 ; also sheet 1,3,4
GYR_INT: JP7.8 U2.98(A:PC8)
M3S_VCTRL: U42.G15(IO_L24N_T3_RS0_15) ; also sheet 3
MAG_DRDY: JP7.6 U2.96(A:PC6)
MIX_RX_EN: U42.D11(IO_L14N_T2_SRCC_15) ; also sheet 3
MIX_TX_EN: U42.C11(IO_L11P_T1_SRCC_15) ; also sheet 3
N$7: C23.1 U2.71(C:VCAP_1)
N$8: C22.1 U2.106(C:VCAP_2)
N$9: C24.1 L5.1 U2.32(C:VREF+) U2.33(C:VDDA)
N$25 [Single_Ended Clocks & RF]: R51.1 U9.B2(C)
N$32: JP3.1 R49.2
N$33: JP3.3 R62.2
N$34: JP3.5 R63.2
N$36: JP3.7 R64.2
N$52: R110.2 U2.50(B:PF12)
N$91: R112.2 U2.53(B:PF13)
N$92: D3.A R114.1
N$93: R113.2 U2.54(B:PF14)
N$94: R114.2 U2.55(B:PF15)
N$95: D2.A R113.1
N$97: D4.A R112.1
N$98: D5.A R110.1
N$106: R138.2 U42.M9(M0_0)
N$107: R139.2 U42.M10(M1_0)
N$108: R140.2 U42.M11(M2_0)
N$109: R141.2 U42.L9(PROGRAM_B_0)
N$114: R142.2 U42.E7(CFGBVS_0)
N$115: R144.1 U42.H10(DONE_0)
N$116: R143.1 U42.K10(INIT_B_0)
STEPPER_CLK+: JP9.4 U2.119(A:PD5)
STEPPER_CW+: JP9.2 U2.118(A:PD4)
STM32_MISO1: U2.42(A:PA6) U42.G14(IO_L21P_T3_DQS_15)
STM32_MISO4: JP1.8 JP13.1 U2.4(B:PE5)
STM32_MISO_1V8: U42.N3(IO_L3P_T0_DQS_34) ; also sheet 3
STM32_MOSI1: U2.43(A:PA7) U42.H13(IO_L20N_T3_A19_15)
STM32_MOSI4: JP1.7 JP13.3 U2.5(B:PE6)
STM32_MOSI_1V8: U42.M1(IO_L2N_T0_34) ; also sheet 3
STM32_NRST: C164.2 JP2.5 R111.1 S1.3 S1.4 U2.25(B:NRST)
STM32_OSC_32_N [Differential]: C18.1 U2.8(A:PC14) XTAL3.2
STM32_OSC_32_P [Differential]: C19.1 U2.9(A:PC15) XTAL3.1
STM32_OSC_N [Differential]: C20.1 U2.23(B:PH0) XTAL1.2
STM32_OSC_P [Differential]: C21.1 U2.24(B:PH1) XTAL1.1
STM32_RX3: JP17.2 U2.70(A:PB11)
STM32_RX5: JP8.3 U2.116(A:PD2)
STM32_SCL1 [Single_Ended Clocks & RF]: R170.2 U2.136(A:PB6) ; also sheet 4
STM32_SCL2 [Single_Ended Clocks & RF]: R172.2 U2.11(B:PF1) ; also sheet 4
STM32_SCL3 [Single_Ended Clocks & RF]: JP7.4 JP18.2 R167.2 U2.100(A:PA8)
STM32_SCLK1 [Single_Ended Clocks & RF]: U2.41(A:PA5) U42.J16(IO_L23N_T3_FWE_B_15)
STM32_SCLK4 [Single_Ended Clocks & RF]: JP1.6 JP13.2 U2.1(B:PE2)
STM32_SCLK_1V8 [Single_Ended Clocks & RF]: U42.P5(IO_L10P_T1_34) ; also sheet 3
STM32_SDA1: R169.2 U2.137(A:PB7) ; also sheet 4
STM32_SDA2: R171.2 U2.10(B:PF0) ; also sheet 4
STM32_SDA3: JP7.5 JP18.1 R168.2 U2.99(A:PC9)
STM32_SWCLK [Single_Ended Clocks & RF]: JP2.2 U2.109(A:PA14)
STM32_SWDIO: JP2.4 U2.105(A:PA13)
STM32_SWO: JP2.6 U2.133(A:PB3)
STM32_TX3: JP17.1 U2.69(A:PB10)
STM32_TX5: JP8.2 U2.113(A:PC12)
STM32_USB_FS_D_N [Differential]: U2.103(A:PA11) X53.2
STM32_USB_FS_D_P [Differential]: U2.104(A:PA12) X53.3
STM32_USB_FS_ID: U2.102(A:PA10) X53.4
Unconnected: JP3.4 JP3.6 JP4.2 JP7.1 JP10.2 R60.1 R60.2 R61.1 R61.2 R83.1 R83.2 R84.1 R84.2 R145.1 R145.2 R146.1 R146.2 U2.2(B:PE3) U2.3(B:PE4) U2.7(A:PC13) U2.12(B:PF2) U2.26(A:PC0) U2.27(A:PC1) U2.28(A:PC2) U2.29(A:PC3) U2.40(A:PA4) U2.44(A:PC4) U2.45(A:PC5) U2.46(A:PB0) U2.47(A:PB1) U2.48(A:PB2) U2.49(B:PF11) U2.73(A:PB12) U2.74(A:PB13) U2.75(A:PB14) U2.76(A:PB15) U2.101(A:PA9) U2.110(A:PA15) U2.111(A:PC10) U2.112(A:PC11) U2.114(A:PD0) U2.115(A:PD1) U2.117(A:PD3) U2.141(B:PE0) U2.142(B:PE1) U6.1(GND_2) U6.3(VD10_2) U6.4(BE_0) U6.5(BE_1) U6.6(BE_2) U6.7(BE_3) U6.8(TXE_N) U6.9(RXF_N) U6.10(SIWU_N) U6.11(WR_N) U6.12(RD_N) U6.13(OE_N) U6.15(RESET_N) U6.16(WAKEUP_N) U6.17(GPIO0) U6.18(GPIO1) U6.19(RESERVED) U6.21(XI) U6.22(XO) U6.23(DP) U6.25(DM) U6.26(GND_3) U6.27(RREF) U6.29(GND_4) U6.30(VD10_3) U6.31(TODN) U6.32(TODP) U6.33(VD10_4) U6.34(RIDN) U6.35(RIDP) U6.36(GND_5) U6.39(DV10) U6.40(DATA_0) U6.41(DATA_1) U6.42(DATA_2) U6.43(DATA_3) U6.44(DATA_4) U6.45(DATA_5) U6.46(DATA_6) U6.47(DATA_7) U6.48(VD10) U6.50(DATA_8) U6.51(DATA_9) U6.52(DATA_10) U6.53(DATA_11) U6.54(DATA_12) U6.55(DATA_13) U6.56(DATA_14) U6.57(DATA_15) U6.58(CLK) U6.60(DATA_16) U6.61(DATA_17) U6.62(DATA_18) U6.63(DATA_19) U6.64(DATA_20) U6.65(DATA_21) U6.66(DATA_22) U6.67(DATA_23) U6.69(DATA_24) U6.70(DATA_25) U6.71(DATA_26) U6.72(DATA_27) U6.73(DATA_28) U6.74(DATA_29) U6.75(DATA_30) U6.76(DATA_31) U6.77(GND) U9.A2(NC) U9.A3(RFU_2) U9.A5(RFU_3) U9.B1(RFU_4) U9.B5(RFU_5) U9.C1(RFU_6) U9.C3(RFU_7) U9.C5(RFU_8) U9.D1(RFU_9) U9.D5(RFU_10) U9.E1(RFU_11) U9.E2(RFU_12) U9.E3(RFU_13) U9.E4(RFU_14) U9.E5(RFU) U42.A2(IO_L8N_T1_AD14N_35) U42.A3(IO_L4N_T0_35) U42.A4(IO_L3N_T0_DQS_AD5N_35) U42.A5(IO_L3P_T0_DQS_AD5P_35) U42.A7(IO_L1N_T0_AD4N_35) U42.B1(IO_L9N_T1_DQS_AD7N_35) U42.B2(IO_L8P_T1_AD14P_35) U42.B4(IO_L4P_T0_35) U42.B5(IO_L2N_T0_AD12N_35) U42.B6(IO_L2P_T0_AD12P_35) U42.B7(IO_L1P_T0_AD4P_35) U42.B9(IO_L3P_T0_DQS_AD1P_15) U42.B12(IO_L5P_T0_AD9P_15) U42.B14(IO_L8N_T1_AD10N_15) U42.B15(IO_L9P_T1_DQS_AD3P_15) U42.B16(IO_L10N_T1_AD11N_15) U42.C1(IO_L9P_T1_DQS_AD7P_35) U42.C2(IO_L7N_T1_AD6N_35) U42.C3(IO_L7P_T1_AD6P_35) U42.C4(IO_L12N_T1_MRCC_35) U42.C6(IO_L5N_T0_AD13N_35) U42.C7(IO_L5P_T0_AD13P_35) U42.C8(IO_L1P_T0_AD0P_15) U42.C9(IO_L1N_T0_AD0N_15) U42.C12(IO_L11N_T1_SRCC_15) U42.C14(IO_L8P_T1_AD10P_15) U42.C16(IO_L10P_T1_AD11P_15) U42.D1(IO_L10N_T1_AD15N_35) U42.D3(IO_L11N_T1_SRCC_35) U42.D4(IO_L12P_T1_MRCC_35) U42.D5(IO_L6N_T0_VREF_35) U42.D6(IO_L6P_T0_35) U42.D8(IO_L6P_T0_15) U42.D9(IO_L6N_T0_VREF_15) U42.D10(IO_0_15) U42.D13(IO_L12P_T1_MRCC_15) U42.D14(IO_L15P_T2_DQS_15) U42.D15(IO_L15N_T2_DQS_ADV_B_15) U42.E1(IO_L15N_T2_DQS_35) U42.E2(IO_L10P_T1_AD15P_35) U42.E3(IO_L11P_T1_SRCC_35) U42.E5(IO_L13N_T2_MRCC_35) U42.E6(IO_0_35) U42.E11(IO_L14P_T2_SRCC_15) U42.E13(IO_L13N_T2_MRCC_15) U42.F2(IO_L15P_T2_DQS_35) U42.F3(IO_L14N_T2_SRCC_35) U42.F4(IO_L14P_T2_SRCC_35) U42.F5(IO_L13P_T2_MRCC_35) U42.F12(IO_L16P_T2_A28_15) U42.G1(IO_L17N_T2_35) U42.G2(IO_L17P_T2_35) U42.G4(IO_L16N_T2_35) U42.G5(IO_L16P_T2_35) U42.G11(IO_25_15) U42.H1(IO_L20N_T3_35) U42.H2(IO_L20P_T3_35) U42.H3(IO_L21N_T3_DQS_35) U42.H4(IO_L18N_T2_35) U42.H5(IO_L18P_T2_35) U42.J1(IO_L22N_T3_35) U42.J3(IO_L21P_T3_DQS_35) U42.J4(IO_L19N_T3_VREF_35) U42.J5(IO_L19P_T3_35) U42.K1(IO_L22P_T3_35) U42.K2(IO_L24N_T3_35) U42.K3(IO_L24P_T3_35) U42.K5(IO_25_35) U42.K12(IO_0_14) U42.K13(IO_L5P_T0_D06_14) U42.L2(IO_L23N_T3_35) U42.L3(IO_L23P_T3_35) U42.L14(IO_L4P_T0_D04_14) U42.M12(IO_L6N_T0_D08_VREF_14) U42.M14(IO_L4N_T0_D05_14) U42.M15(IO_L3N_T0_DQS_EMCCLK_14) U42.M16(IO_L7P_T1_D09_14) U42.N9(IO_L18P_T2_A12_D28_14) U42.N13(IO_L11P_T1_SRCC_14) U42.N16(IO_L7N_T1_D10_14) U42.P6(IO_25_14) U42.P8(IO_L20P_T3_A08_D24_14) U42.P9(IO_L18N_T2_A11_D27_14) U42.P10(IO_L14P_T2_SRCC_14) U42.P11(IO_L14N_T2_SRCC_14) U42.P13(IO_L11N_T1_SRCC_14) U42.R5(IO_L23P_T3_A03_D19_14) U42.R8(IO_L20N_T3_A07_D23_14) U42.R12(IO_L15P_T2_DQS_RDWR_B_14) U42.T3(IO_L9N_T1_DQS_34) U42.T12(IO_L15N_T2_DQS_DOUT_CSO_B_14) X53.1

### Notes on the sheet
- DIGITAL (FPGA + MICROCONTROLLER)